# Altium schematic sheet Digit_Board_add.SchDoc
size A
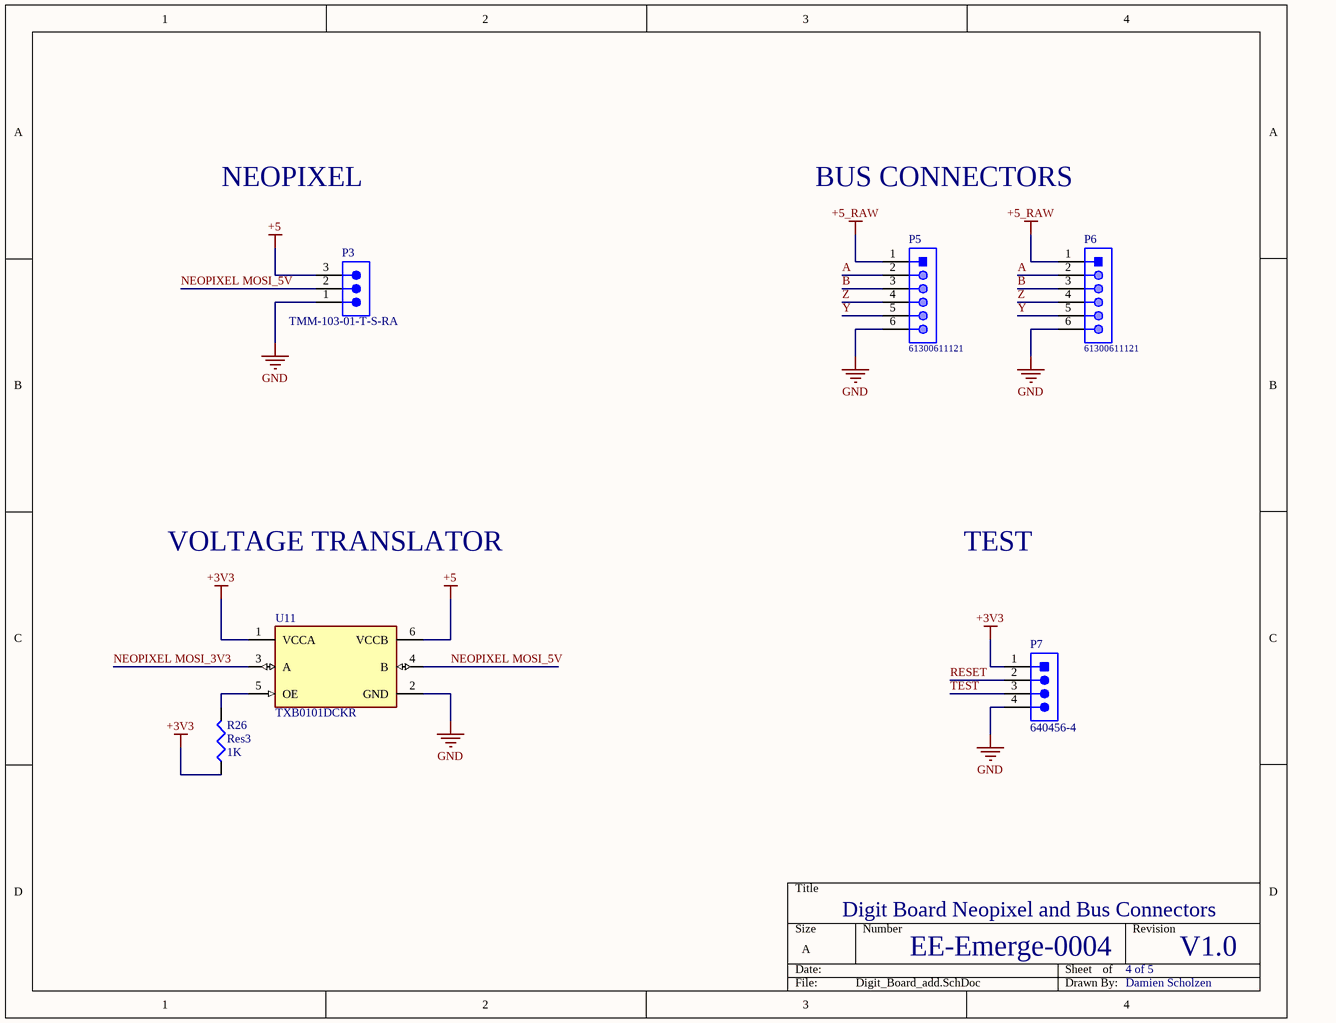
[diagram p0: Digit_Board_add.SchDoc]

## Parts
P3  TMM-103-01-T-S-RA  [SMTC-TMM-103-01-X-S-RA]
P5  61300611121  [61300611121]
P6  61300611121  [61300611121]
P7  640456-4  [TECO-640456-4]
R26  Res3  value 1K  [6-0805_N]
U11  TXB0101DCKR  [FP-DCK0006A-MFG]

## Nets
+3V3: P7.1 R26.1 U11.1(VCCA)
+5: P3.3 U11.6(VCCB)
+5_RAW: P5.1 P6.1
GND: P3.1 P5.6 P6.6 P7.4 U11.2(GND)
A: P5.2 P6.2
B: P5.3 P6.3
NEOPIXEL MOSI_3V3: U11.3(A)
NEOPIXEL MOSI_5V: P3.2 U11.4(B)
RESET: P7.2
TEST: P7.3
Y: P5.5 P6.5
Z: P5.4 P6.4
NetR26_2: R26.2 U11.5(OE)

## Notes on the sheet
- NEOPIXEL
- BUS CONNECTORS
- VOLTAGE TRANSLATOR
- TEST
- Digit Board Neopixel and Bus Connectors
- EE-Emerge-0004
- 4 of 5
- V1.0
- Damien Scholzen

## Library data of the parts
P3 = CMP-1029-00176-1: Low Profile Through-Hole Header, Right Angle, -55 to 105 degC, 2 mm Pitch, 3-Pin, Male, RoHS; Manufacturer: Samtec; Pitch: 2 mm; PackageDescription: 2 mm Terminal Strip Assembly (R/A); Mounting Technology: Through-hole; ComponentLink3URL: http://www.samtec.com/documents/webfiles/cpdf/TMM-1XX-XX-XX-X-RA-XXX-MKT.pdf; RoHS: True; Temperature Range: -55 to 105 degC; PackageVersion: V, 3/2013; ComponentLink3Description: Package Specification; ComponentLink1Description: Manufacturer URL; ComponentLink2Description: Datasheet; PackageReference: TMM-103-01-X-S-RA; ComponentLink1URL: http://www.samtec.com; PartNumber: TMM-103-01-T-S-RA; DatasheetVersion: F-214; Orientation: Right Angle; ComponentLink2URL: http://d2a072wq521u33.cloudfront.net/catalog_english//TMM_TH.PDF; Manufacturer 1: Samtec; Manufacturer Part Number 1: TMM-103-01-T-S-RA
P5 P6 = CMP-1502-01070-1: THT Vertical Pin Header WR-PHD, Pitch 2.54 mm, Single Row, 6 pins; Manufacturer: Wurth Elektronik; Gender: Male; Pin Number: 6; Pitch: 2.54mm; Working Voltage: 250VAC; Rated Current: 3A; Withstanding Voltage: 500VAC; Contact Resistance: 20mOhm; Operating Temperature: -40to105degC; Packaging: Bag; Datasheet URL: https://katalog.we-online.de/em/datasheet/6130xx11121.pdf; Package Reference: 61300611121; Mounting Technology: THT; Publisher: WurthElektronik; Part Number: 61300611121; Manufacturer URL: http://www.we-online.de; Row Number: Single; Orientation: Vertical
P7 = CMP-2000-05419-1: Male Header, Pitch 2.54 mm, 1 x 4 Position, Height 10.03 mm, Tail Length 3.56 mm, RoHS, Bulk; Manufacturer: TE Connectivity; Material, Housing: Polyester; Primary Type: InterconnectSystem; Mount Angle: Vertical; Color, Housing: White; Current, Rating: 5 / A; Agency Approvals: CSA,UL; Contact Termination Area Plating: Tin; Temperature, Operating: -55to+105 / degC; Standards: RoHSCompliant,ELVCompliant,UL94V-0; Number of Positions: 4; Brand/Series: MTA-100Series; Angle: Straight; Pin Spacing: 0.1 / "; Material, Contact: CopperAlloy; Connector Type: MTA-100; Special Features: Pinstrip; Mounting Hole Size: 0.04 / "; Contact Centerline Spacing: 0.100 / in.; Voltage, Rating: 250 / V; Manufacturer URL: http://www.te.com/; Length, Pin: 0.14 / "; Length, Overall: 0.4 / "; Color: White; Flammability Rating: UL94V-0; Mounting Type: PCMount; Termination: Solder; Datasheet URL: https://datasheet.ciiva.com/16286/eng-ds-82056-mta-0608-16286228.pdf; Number of Contacts: 4; Contact Shape: Square; Contact Mating Area Plating: Tin; Length, Terminal Post: 0.14 / in.; Size, Post: 0.025 / in.; Contact Plating: Tin; Type: PCBPlug; Datasheet Version: Dec-14; Number of Rows: 1
R26 = Res3_2: Resistor; Published: 8-Jun-2000; LatestRevisionDate: 29-May-2009; LatestRevisionNote: IPC-7351 Footprint Added.; PackageReference: J1-0603; Publisher: Altium Limited; PackageDescription: Chip Resistor
U11 = CMP-04899-000110-1: IC TRNSLTR BIDIRECTIONAL SC70-6; Number of Bits: 1; Low Level Output Current: 20uA; Data Rate: 100Mbps; Logic Function: Translator; Min Supply Voltage: 1.2V; Turn-On Delay Time: 7.4ns; Propagation Delay: 31ns; High Level Output Current: -20uA; Max Supply Voltage: 5.5V; Series: -; Height: 1mm; Packaging: Tape and Reel; RoHS Compliant: Yes; Width: 1.4mm; Package Quantity: 1; Mount: Surface Mount; Case/Package: SC; Length: 2.15mm; Number of Pins: 6; Max Operating Temperature: 85°C; Contact Plating: Gold; Min Operating Temperature: -40°C; Radiation Hardening: No; Lead Free: Lead Free; Number of Inputs: 1; Number of Channels: 1; REACH SVHC: No SVHC